# Altium schematic sheet RFRX.SchDoc: Receiver Front End
size Legal; CheckedBy: J. Brinton; CompanyName: Signal Laboratories, Inc.; DrawnBy: J. Brinton; Engineer: J. Brinton; Address1: 3479 Edison Way; Address2: Menlo Park CA 94025; Address3: +1 (877) 778-8435; Address4: siglabs.com; DocumentNumber: 48; Revision: 2b; SheetNumber: 49; SheetTotal: 58
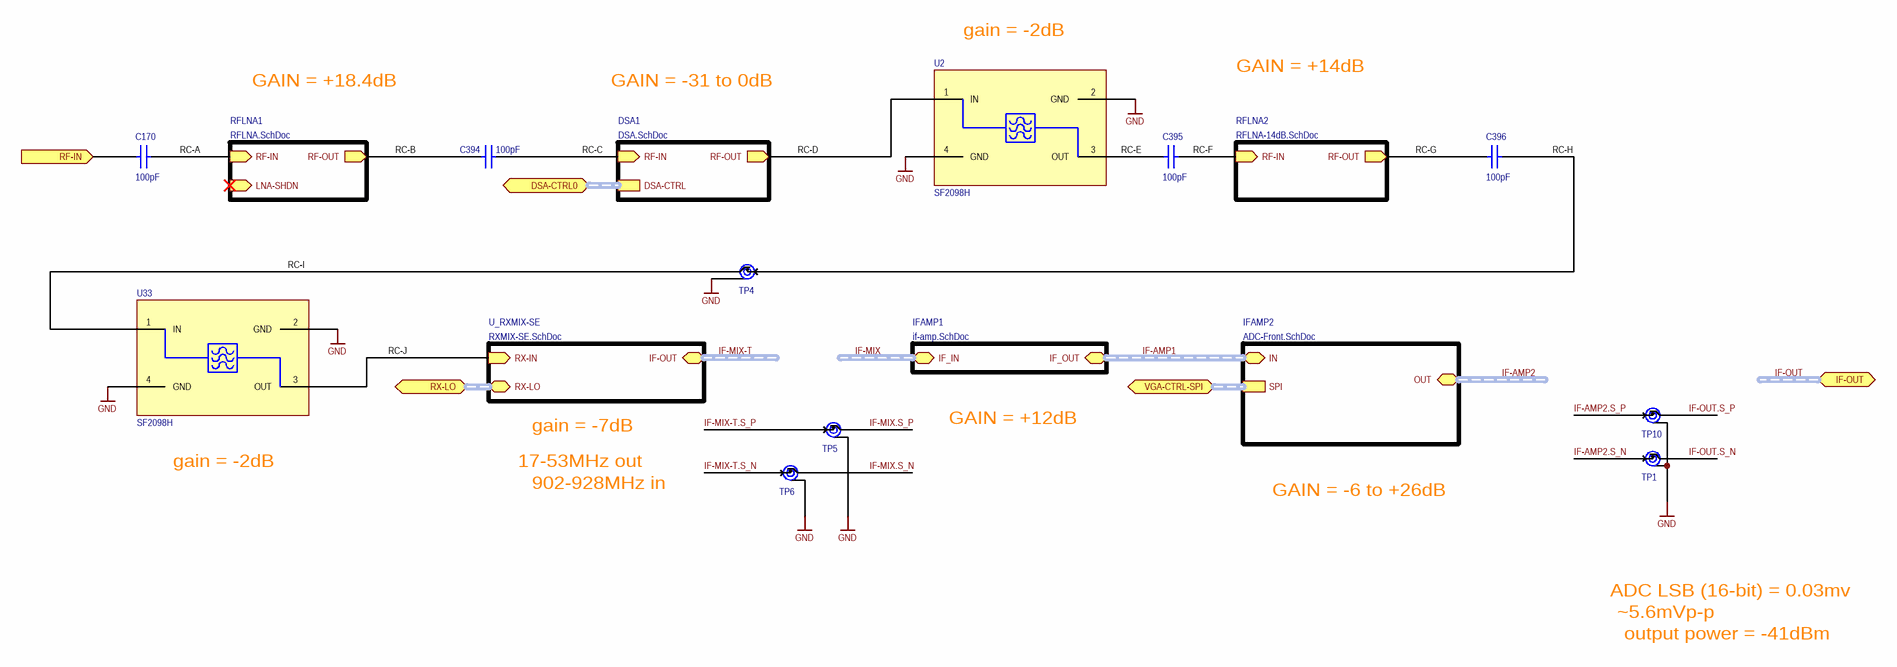
[diagram p0: RFRX.SchDoc]

## Parts
C170  value 100pF  [0402]  (hidden comment: CBR04C101F3GAC)
C394  value 100pF  [0402]  (hidden comment: CBR04C101F3GAC)
C395  value 100pF  [0402]  (hidden comment: CBR04C101F3GAC)
C396  value 100pF  [0402]  (hidden comment: CBR04C101F3GAC)
TP1  MS-180(20)  [MS-180(20)]  (value not drawn)
TP4  MS-180(20)  [MS-180(20)]  (value not drawn)
TP5  MS-180(20)  [MS-180(20)]  (value not drawn)
TP6  MS-180(20)  [MS-180(20)]  (value not drawn)
TP10  MS-180(20)  [MS-180(20)]  (value not drawn)
U2  SF2098H  [SM2016-4]
U33  SF2098H  [SM2016-4]

## Sub-sheets
DSA1 = DSA.SchDoc: RF-IN (in), RF-OUT (out), DSA-CTRL (harness DSA_CTRL)
IFAMP1 = if-amp.SchDoc: IF_OUT (harness DIFF100), IF_IN (harness DIFF100)
IFAMP2 = ADC-Front.SchDoc: SPI (harness SPI), IN (harness DIFF100), OUT (harness DIFF100)
RFLNA1 = RFLNA.SchDoc: RF-IN (in), LNA-SHDN (in), RF-OUT (out)
RFLNA2 = RFLNA-14dB.SchDoc: RF-IN (in), RF-OUT (out)
U_RXMIX-SE = RXMIX-SE.SchDoc: RX-IN (in), IF-OUT (harness DIFF100), RX-LO (harness CLK-LVDS)

## Ports
DSA-CTRL0 (harness DSA_CTRL), IF-OUT (harness DIFF100), RF-IN (in), RX-LO (harness CLK-LVDS), VGA-CTRL-SPI (harness SPI)

## Nets
GND: TP1.G(GND) TP4.G(GND) TP5.G(GND) TP6.G(GND) TP10.G(GND) U2.2(GND) U2.4(GND) U33.2(GND) U33.4(GND)
IF-AMP2.S_N: TP1.C(IN)
IF-AMP2.S_P: TP10.C(IN)
IF-MIX-T.S_N: TP6.C(IN)
IF-MIX-T.S_P: TP5.C(IN)
IF-MIX.S_N: TP6.A(OUT)
IF-MIX.S_P: TP5.A(OUT)
IF-OUT.S_N: TP1.A(OUT)
IF-OUT.S_P: TP10.A(OUT)
RC-A: C170.1 ; sheet RFLNA1/RF-IN
RC-B: C394.2 ; sheet RFLNA1/RF-OUT
RC-C: C394.1 ; sheet DSA1/RF-IN
RC-D: U2.1(IN) ; sheet DSA1/RF-OUT
RC-E: C395.2 U2.3(OUT)
RC-F: C395.1 ; sheet RFLNA2/RF-IN
RC-G: C396.2 ; sheet RFLNA2/RF-OUT
RC-H: C396.1 TP4.C(IN)
RC-I: TP4.A(OUT) U33.1(IN)
RC-J: U33.3(OUT) ; sheet U_RXMIX-SE/RX-IN
RF-IN: C170.2 ; port RF-IN

## Buses and harness runs
harness IF-AMP1 = sheet IFAMP1/IF_OUT = sheet IFAMP2/IN
harness IF-AMP2 = sheet IFAMP2/OUT
harness IF-MIX = sheet IFAMP1/IF_IN
harness IF-MIX-T = sheet U_RXMIX-SE/IF-OUT
harness IF-OUT = port IF-OUT
harness port DSA-CTRL0 = sheet DSA1/DSA-CTRL
harness port RX-LO = sheet U_RXMIX-SE/RX-LO
harness port VGA-CTRL-SPI = sheet IFAMP2/SPI

## Notes on the sheet
- gain = -2dB
- GAIN = +18.4dB
- GAIN = -31 to 0dB
- GAIN = +14dB
- 17-53MHz out
- gain = -7dB
- GAIN = +12dB
- 902-928MHz in
- GAIN = -6 to +26dB
- ADC LSB (16-bit) = 0.03mv
- ~5.6mVp-p
- output power = -41dBm
- Title
- Engineer
- Revision
- Drawn By
- Checked By
- Date
- Sheet
- of

## Library data of the parts
C170 C394-C396 = CAP 0603: Ceramic Capacitor 100pF ±1% 25V NP0 0402; Manufacturer: Kemet; Tr: -55:125; Voltage: 25V; Manufacturer P/N: CBR04C101F3GAC; Package: 0402; Do Not Place: *; Tolerance: ±1%
TP1 TP4-TP6 TP10 = MS-180(20): Coaxial Connector Switch; Manufacturer: Hirose; Manufacturer P/N: MS-180(20)
U2 U33 = SF2098H: 915 MHz SAW Filter; Manufacturer: RFM; Manufacturer P/N: SF2098H